# Altium schematic sheet motordriver-v4.0_power-stage.SchDoc
size A4; SheetNumber: 2; SheetTotal: 3
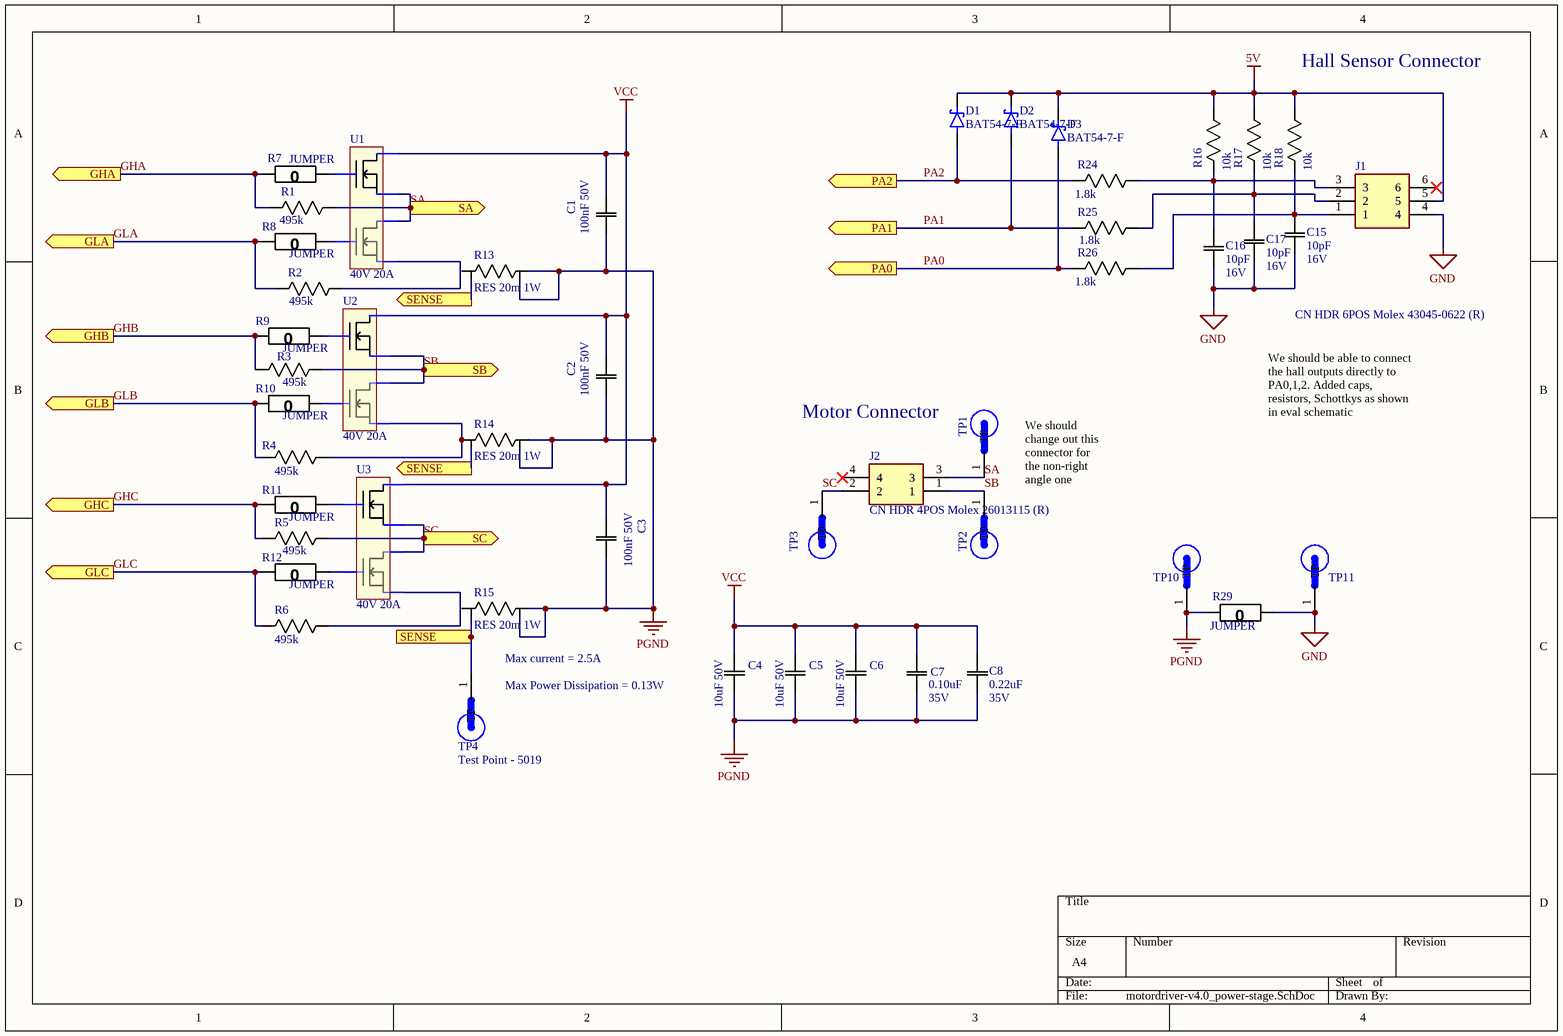
[diagram p0: motordriver-v4.0_power-stage.SchDoc]

## Parts
C1  100nF 50V  [0603]
C2  100nF 50V  [0603]
C3  100nF 50V  [0603]
C4  10uF 50V  [0805]
C5  10uF 50V  [0805]
C6  10uF 50V  [0805]
C7  Rating: 35V  [0603]  (hidden comment: 0.10uF)
C8  Rating: 35V  [0603]  (hidden comment: 0.22uF)
C15  Rating: 16V  [0603]  (hidden comment: 10pF)
C16  Rating: 16V  [0603]  (hidden comment: 10pF)
C17  Rating: 16V  [0603]  (hidden comment: 10pF)
D1  BAT54-7-F  [BAT54-7-F]
D2  BAT54-7-F  [BAT54-7-F]
D3  BAT54-7-F  [BAT54-7-F]
J1  CN HDR 6POS Molex 43045-0622 (R)  [430450622]
J2  CN HDR 4POS Molex 26013115 (R)  [26013115]
R1  495k  [0603]
R2  495k  [0603]
R3  495k  [0603]
R4  495k  [0603]
R5  495k  [0603]
R6  495k  [0603]
R7  JUMPER  [0603]
R8  JUMPER  [0603]
R9  JUMPER  [0603]
R10  JUMPER  [0603]
R11  JUMPER  [0603]
R12  JUMPER  [0603]
R13  RES 20m 1W  [1206 - Sense]
R14  RES 20m 1W  [1206 - Sense]
R15  RES 20m 1W  [1206 - Sense]
R16  10k  [0603]
R17  10k  [0603]
R18  10k  [0603]
R24  1.8k  [0603]
R25  1.8k  [0603]
R26  1.8k  [0603]
R29  JUMPER  [0603]
TP1  Test Point - 5019  [TP380X203]  (value not drawn)
TP2  Test Point - 5019  [TP380X203]  (value not drawn)
TP3  Test Point - 5019  [TP380X203]  (value not drawn)
TP4  Test Point - 5019  [TP380X203]
TP10  Test Point - 5019  [TP380X203]  (value not drawn)
TP11  Test Point - 5019  [TP380X203]  (value not drawn)
U1  40V 20A  [PowerPAK SO8 Dual]
U2  40V 20A  [PowerPAK SO8 Dual]
U3  40V 20A  [PowerPAK SO8 Dual]

## Ports
GHA (out), GHB (out), GHC (out), GLA (out), GLB (out), GLC (out), PA0 (out), PA1 (out), PA2 (out), SA (out), SB (out), SC (out), SENSE (out)

## Nets
5V: D1.3(K) D2.3(K) D3.3(K) J1.5 R16.1(R1) R17.1(R1) R18.1(R1)
GND: C15.1(C1) C16.1(C1) C17.1(C1) J1.4 R29.1(R1) TP11.1(TP)
PGND: C1.1(C1) C2.1(C1) C3.1(C1) C4.2(C2) C5.2(C2) C6.2(C2) C7.1(C1) C8.1(C1) R13.2(R2) R13.4 R14.2(R2) R14.4 R15.2(R2) R15.4 R29.2(R2) TP10.1(TP)
VCC: C1.2(C2) C2.2(C2) C3.2(C2) C4.1(C1) C5.1(C1) C6.1(C1) C7.2(C2) C8.2(C2) U1.8(D1) U2.8(D1) U3.8(D1)
GHA: R1.2(R2) R7.2(R2) ; port GHA
GHB: R3.2(R2) R9.2(R2) ; port GHB
GHC: R5.2(R2) R11.2(R2) ; port GHC
GLA: R2.2(R2) R8.2(R2) ; port GLA
GLB: R4.2(R2) R10.2(R2) ; port GLB
GLC: R6.2(R2) R12.2(R2) ; port GLC
PA0: D3.1(A) R26.2(R2) ; port PA0
PA1: D2.1(A) R25.2(R2) ; port PA1
PA2: D1.1(A) R24.2(R2) ; port PA2
SA: J2.3 R1.1(R1) TP1.1(TP) U1.1(S1) U1.6(D2) ; port SA
SB: J2.1 R3.1(R1) TP2.1(TP) U2.1(S1) U2.6(D2) ; port SB
SC: J2.2 R5.1(R1) TP3.1(TP) U3.1(S1) U3.6(D2) ; port SC
SENSE: R13.3 R14.3 R15.3 TP4.1(TP) ; port SENSE
NetC15_2: C15.2(C2) J1.1 R18.2(R2) R26.1(R1)
NetC16_2: C16.2(C2) J1.3 R16.2(R2) R24.1(R1)
NetC17_2: C17.2(C2) J1.2 R17.2(R2) R25.1(R1)
NetR2_1: R2.1(R1) U1.3(S2)
NetR4_1: R4.1(R1) R14.1(R1) U2.3(S2)
NetR6_1: R6.1(R1) U3.3(S2)
NetR7_1: R7.1(R1) U1.2(G1)
NetR8_1: R8.1(R1) U1.4(G2)
NetR9_1: R9.1(R1) U2.2(G1)
NetR10_1: R10.1(R1) U2.4(G2)
NetR11_1: R11.1(R1) U3.2(G1)
NetR12_1: R12.1(R1) U3.4(G2)

Not connected (* = marked no-connect by the designer): J1 6*; J2 4*; R13 1(R1); R15 1(R1)

## Notes on the sheet
- Hall Sensor Connector
- Motor Connector
- We should be able to connect the hall outputs directly to PA0,1,2. Added caps, resistors, Schottkys as shown in eval schematic
- We should change out this connector for the non-right angle one
- Max current = 2.5A
- Max Power Dissipation = 0.13W

## Library data of the parts
C1-C3 = CAP 100nF 50V: CAP CER 0.1UF 50V X7R 0805; Tolerance: 10%; Package: 0805; Value: 100nF; Rating: 50V
C4-C6 = CAP 10uF 50V: CAP CER 10UF 50V X7R; Tolerance: 10%; Package: 1210; Value: 10uF; Rating: 50V; ComponentLink1Description: digikey; ComponentLink1URL: https://www.digikey.ca/en/products/detail/kemet/C1210C106M5RACTU/4918883
C7 = CAP 0.10uF 35V: CAP CER 0.10UF 35V X7R 0603/0805; Tolerance: 10%; Package: 0603/0805; Temperature Coefficient: X7R; Operating Temperature: -55°C ~ 125°C; Value: 0.10uF
C8 = CAP 0.22uF 35V: CAP CER 0.22UF 35V X7R 0603/0805; Tolerance: 10%; Package: 0603/0805; Temperature Coefficient: X7R; Operating Temperature: -55°C ~ 125°C; Value: 0.22uF
C15-C17 = CAP 10pF 16V: CAP CER 10PF 16V X5R 0603; Tolerance: 10%; Package: 0603; Temperature Coefficient: X5R; Operating Temperature: -55°C ~ 85°C; Value: 10pF
D1-D3 = DIODE SCHOTTKY BAT54-7-F: DIODE SCHOTTKY 30V 200MA SOT23-3; Manufacturer: Diodes Incorporated; VDC Reverse: 30 V; Digikey Link: https://www.digikey.ca/en/products/detail/diodes-incorporated/BAT54-7-F/717699; Digikey PN: BAT54-FDICT-ND
J1 = CN HDR 6POS Molex 43045-0622 (R): Molex 43045-0622 6POS Microfit / dual row, right angle
J2 = CN HDR 4POS Molex 26013115 (R): Molex 26013115 4POS Minifit / dual row, right angle
R1-R6 = RES 495k 1/8W: RES SMD 499K OHM 1% 1/8W 0805; Manufacturer: Yageo; Manufacturer Part Number: RC0805FR-07499KL; Temperature Coefficient: 100ppm/°C; Voltage Rating (DC): 150V; Resistance: 499kR; Power Rating: 125mW; Supplier 1: Digi-Key; RoHS: Yes; Category: Chip SMD Resistors; Stock 1: 2275; Pricing 1: 1=0.10000, 10=0.04000, 100=0.01630, 1000=0.00731, 2500=0.00635 (USD); Case/Package: 0805; Case Code (Metric): 2012; Case Code (Imperial): 0805; Contact Plating: Tin,Lead,Matte; Min Operating Temperature: -55°C; Max Operating Temperature: 155°C; Termination: SMD/SMT; Composition: Thick Film; Military Standard: Not; Tolerance: 1%; Voltage Rating: 150V; Packaging: Tape and Reel; Length: 2mm; Depth: 1.25mm; Radiation Hardening: No; Lead Free: Lead Free; ComponentLink1URL: https://datasheet.ciiva.com/15189/getdatasheetpartid-326570-15189975.pdf?src-supplier=Verical; ComponentLink1Description: https://datasheet.ciiva.com/15189/getdatasheetpartid-326570-15189975.pdf?src-supplier=Verical; Supplier Part Number 1: 311-499KCRCT-ND
R7-R12 R29 = RES 0 JUMPER: RES SMD 0 OHM JUMPER GENERIC 0805; Value: 0; Package: 0805
R13-R15 = RES 20m 1W: RES SMD 0.02 OHM 1% 1W 1206
R16-R18 = RES 10k 1/8W - 1%: RES SMD 10K OHM 1% 1/8W 0805; Power (Watts): 0.125W; Package: 0805; Value: 10k; Tolerance: 1%
R24-R26 = RES 1.8k 1/8W: RES SMD 1.8K OHM 5% 1/8W 0805; Power (Watts): 0.125W; Package: 0805; Value: 1.8k; Tolerance: 5%
TP1-TP4 TP10 TP11 = Test Point - 5019: PC Test Point, Miniature Phosphor Bronze, Silver Plating Surface Mount Mounting Type; MP: 5019; MF: Keystone Electronics; Value: *; Package: 2010 Keystone; Digi-Key_Part_Number: 36-5019CT-ND; Digi-Key_Purchase_URL: https://www.digikey.com/product-detail/en/keystone-electronics/5019/36-5019CT-ND/3907344?utm_source=snapeda&utm_medium=aggregator&utm_campaign=symbol
U1-U3 = MOSFET N-CH DUAL 40V 20A: MOSFET N+N 40V 20A; MF: Vishay Siliconix; MF P/N: Si7288DP; Supplier 1: Digi-Key; Supplier Part Number 1: SI7288DP-T1-GE3CT-ND